# Altium schematic sheet Relay_ORWH-SH-105D1F.SchDoc
size A4
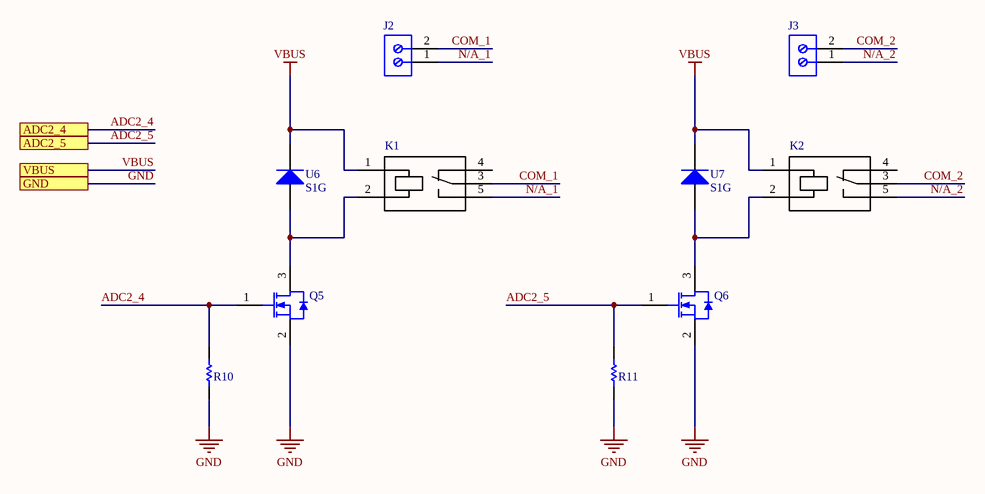
[diagram p0: Relay_ORWH-SH-105D1F.SchDoc]

## Parts
J2  691709710302  [691709710302]  (value not drawn)
J3  691709710302  [691709710302]  (value not drawn)
K1  ORWH-SH-105D1F,000  [TE_ORWH-SH-105D1F,000]  (value not drawn)
K2  ORWH-SH-105D1F,000  [TE_ORWH-SH-105D1F,000]  (value not drawn)
Q5  BSS138-7-F  [DIOD-SOT23-3_V]  (value not drawn)
Q6  BSS138-7-F  [DIOD-SOT23-3_V]  (value not drawn)
R10  RK73B2ATTD103J  [RESC2013X60X30NL20T20]  (value not drawn)
R11  RK73B2ATTD103J  [RESC2013X60X30NL20T20]  (value not drawn)
U6  S1G  [FAIR-DO-214AC-2_V]
U7  S1G  [FAIR-DO-214AC-2_V]

## Ports
ADC2_4, ADC2_5, GND, VBUS

## Nets
GND: Q5.2(S) Q6.2(S) R10.2 R11.2 ; port GND
VBUS: K1.1(C1) K2.1(C1) U6.2(K) U7.2(K) ; port VBUS
ADC2_4: Q5.1(G) R10.1 ; port ADC2_4
ADC2_5: Q6.1(G) R11.1 ; port ADC2_5
COM_1: J2.2 K1.3(C)
COM_2: J3.2 K2.3(C)
N/A_1: J2.1 K1.5(NO)
N/A_2: J3.1 K2.5(NO)
NetK1_2: K1.2(C2) Q5.3(D) U6.1(A)
NetK2_2: K2.2(C2) Q6.3(D) U7.1(A)

Not connected (* = marked no-connect by the designer): K1 4(NC); K2 4(NC)

## Library data of the parts
J2 J3 = CMP-1502-03335-1: Serie 7097 - 5.00 mm Horizontal Entry SMT with Pressure Clamp WR-TBL, 2 pin; Manufacturer: Wurth Elektronik; Pitch: 5.00mm; Pin Number: 2; Datasheet URL: http://katalog.we-online.de/em/datasheet/6917097103xx.pdf; Mounting Technology: SMT; Packaging: TapeandReelwithCap; Manufacturer URL: http://www.we-online.de; Publisher: WurthElektronik; Part Number: 691709710302; Operating Temperature: -45to130degC; Package Reference: 691709710302
K1 K2 = ORWH-SH-105D1F,000: Electromechanical Relay 5VDC 15A SPDT __ 19.2mm 15.5mm 15mm__ THT General Purpose Relay; MF: TE Connectivity; Package: None; Digi-Key_Part_Number: PB2032-ND; TE_purchase_URL: https://www.te.com/usa-en/product-1-1721150-0.html?te_bu=Cor&te_type=disp&te_campaign=seda_glo_cor-seda-global-disp-prtnr-fy19-seda-model-bom-cta_sma-317_1&elqCampaignId=32493; Digi-Key_Purchase_URL: https://www.digikey.com.co/product-detail/en/te-connectivity-potter-brumfield-relays/ORWH-SH-105D1F,000/PB2032-ND/4925028?utm_source=snapeda&utm_medium=aggregator&utm_campaign=symbol; SnapEDA_Link: https://www.snapeda.com/parts/ORWH-SH-105D1F%2C000/TE%20Connectivity%20Potter%20%26%20Brumfield%20Relays/view-part/?ref=snap; MP: ORWH-SH-105D1F,000; Value: *
Q5 Q6 = CMP-2000-04930-1: N-Channel Enhancement Mode Mosfet, 50 V, 0.2 A, -55 to 150 degC, 3-Pin SOT23, RoHS, Tape and Reel; Manufacturer: Diodes Inc; Brand: DiodesIncorporated; Unit Weight: 0.000282oz; Pd - Power Dissipation: 300mW; Id - Continuous Drain Current: 200mA; Rds On - Drain-Source Resistance: 3.5Ohms; Vgs - Gate-Source Voltage: 20V; Number of Channels: 1Channel; Vds - Drain-Source Breakdown Voltage: 50V; Transistor Type: 1N-Channel; Typical Turn-Off Delay Time: 20ns; Configuration: Single; Mounting Style: SMD/SMT; Height: 1mm; Package Description: 3-Pin Small Outline Transistor, Body 2.9 x 1.3 mm, Pitch 0.96 mm; Datasheet Version: Rev. 20-2, 11/2013; Minimum Operating Temperature: -55C; Package / Case: SOT-23-3; Channel Mode: Enhancement; Product: MOSFETSmallSignal; Packaging: Reel; Maximum Operating Temperature: +150C; Datasheet URL: https://datasheet.ciiva.com/8115/ds30144-8115344.pdf; Product Category: MOSFET; Width: 1.3mm; Technology: Si; Package Reference: SOT23-3; Manufacturer URL: http://www.diodes.com/; Transistor Polarity: N-Channel; Length: 2.9mm; Factory Pack Quantity: 3000; Series: BSS138; RoHS: True; Typical Turn-On Delay Time: 20ns
R10 R11 = CMP-2001-04657-1: 10 kOhms ±5% 0.25W, 1/4W Chip Resistor 0805 (2012 Metric) Automotive AEC-Q200, Moisture Resistant Thick Film; Manufacturer: KOA Speer; Part Number: RK73B2ATTD103J
U6 U7 = CMP-2000-07011-1: General Purpose Rectifier, 1.4 W, -55 to 150 degC, 2-Pin DO-214AC, RoHS, Tape and Reel; Manufacturer: Fairchild Semiconductor; Reverse Recovery Time-Max: 1.8µs; Forward Voltage: 1.1V; Trr: 1800ns; VRRM Max: 400V; Power Dissipation Max: 1400mW; Average Rectified Current-Max: 1A; Reverse Current-Max: 1µA; Mounting Technology: SurfaceMount; Manufacturer URL: https://www.fairchildsemi.com/; Package URL: https://www.fairchildsemi.com/package-drawings/DO/DO214AC.pdf; Datasheet URL: https://www.fairchildsemi.com/datasheets/S1/S1G.pdf; Package Description: 2-Pin Surface Mount Device, Body 4.375 x 2.725 mm; Reverse Voltage-Max [Vrrm]: 400V; Package Reference: DO-214AC-2; Datasheet Version: Rev. 2.10, 05/2015; PartNumber: S1G